# Altium schematic sheet SchemaC-mcu.SchDoc
size A3; Organization: ETML-ES; Address1: Avenue Recordon 1; Address2: 1004 Lausanne; Address3: Switzerland; SheetNumber: 3; SheetTotal: 3
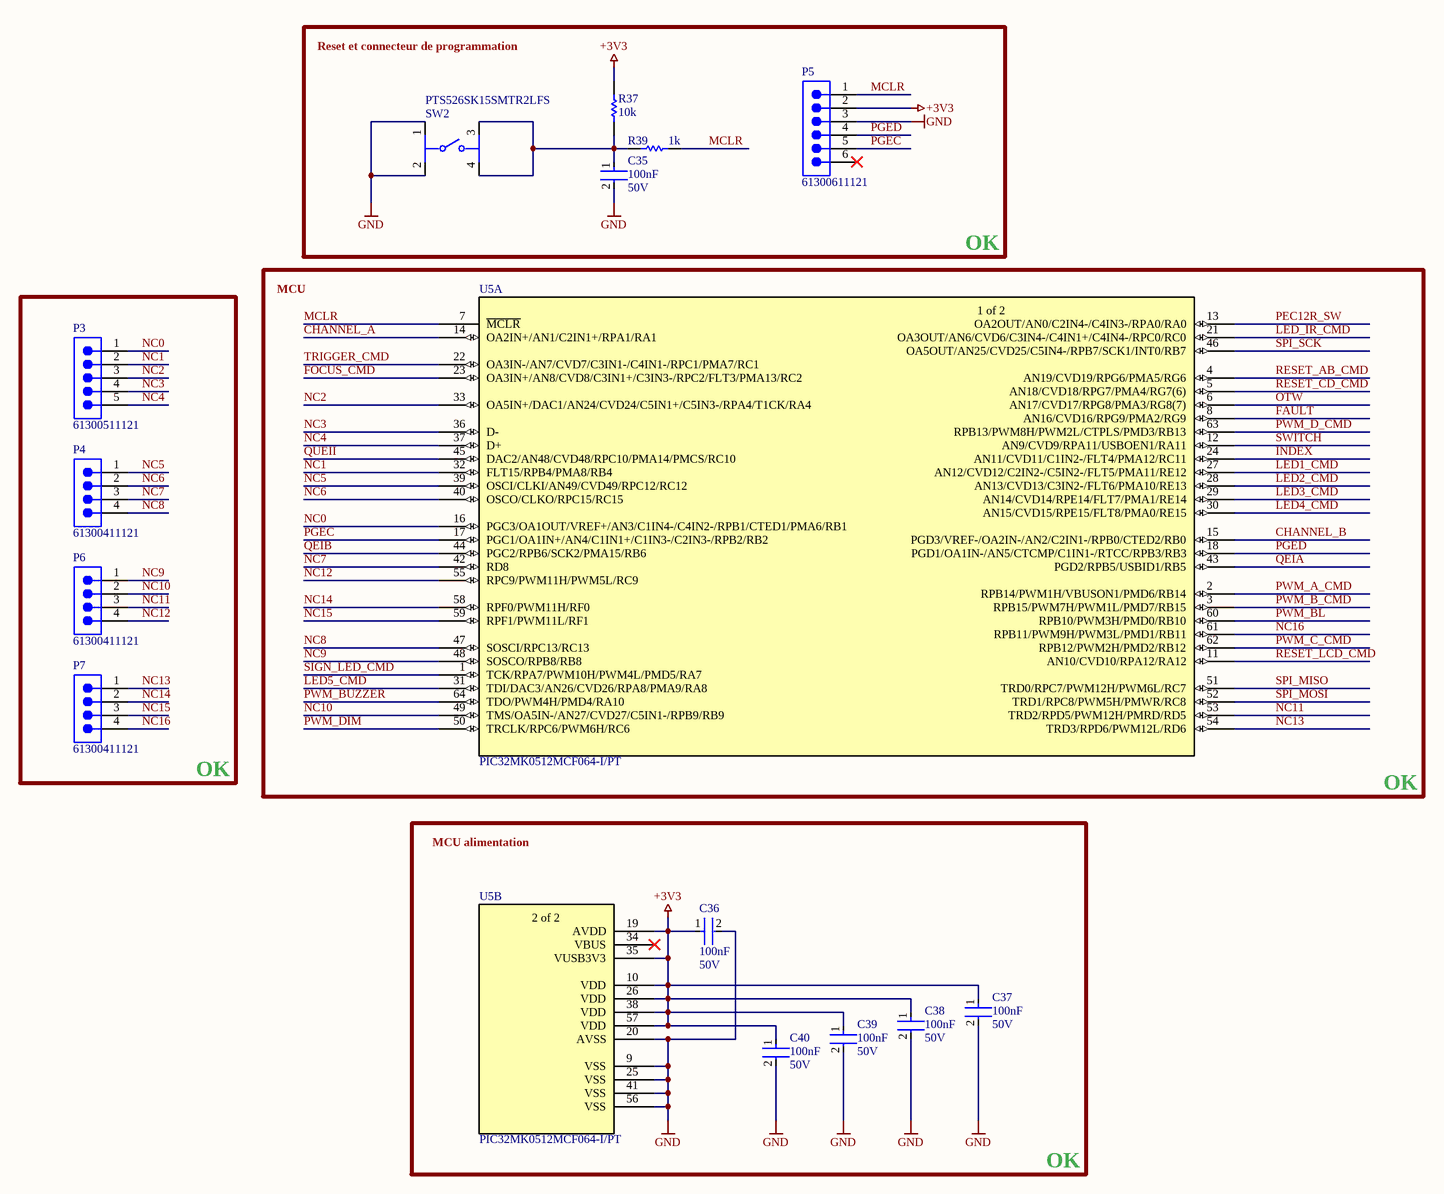
[diagram p0: SchemaC-mcu.SchDoc]

## Parts
C35  Capacitance: 100nF  Voltage Rating: 50V  [FP-CL21-IPC_C]  (hidden comment: CL21B104KBCNNNC)
C36  Capacitance: 100nF  Voltage Rating: 50V  [FP-CL21-IPC_C]  (hidden comment: CL21B104KBCNNNC)
C37  Capacitance: 100nF  Voltage Rating: 50V  [FP-CL21-IPC_C]  (hidden comment: CL21B104KBCNNNC)
C38  Capacitance: 100nF  Voltage Rating: 50V  [FP-CL21-IPC_C]  (hidden comment: CL21B104KBCNNNC)
C39  Capacitance: 100nF  Voltage Rating: 50V  [FP-CL21-IPC_C]  (hidden comment: CL21B104KBCNNNC)
C40  Capacitance: 100nF  Voltage Rating: 50V  [FP-CL21-IPC_C]  (hidden comment: CL21B104KBCNNNC)
P3  61300511121  [61300511121]
P4  61300411121  [61300411121]
P5  61300611121  [61300611121]
P6  61300411121  [61300411121]
P7  61300411121  [61300411121]
R37  Resistance: 10k  [RESC2013X60X35ML10T20]  (hidden comment: RC0805JR-0710KL)
R39  Resistance: 1k  [RESC2013X60X35ML10T20]  (hidden comment: RC0805FR-071KL)
SW2  PTS526SK15SMTR2LFS  [FP-PTS526SK15SMTR2LFS-MFG]
U5  PIC32MK0512MCF064-I/PT  [TQFP64_PT_MCH]  (parts A,B of 2)

## Blocks framed on the sheet
OK: C35 P5 R37 R39 SW2
OK: P3 P4 P6 P7
OK: U5
OK: C36-C40 U5

## Nets
+3V3: C36.1 C37.1 C38.1 C39.1 C40.1 P5.2 R37.1 U5.10(VDD) U5.19(AVDD) U5.26(VDD) U5.35(VUSB3V3) U5.38(VDD) U5.57(VDD)
GND: C35.2 C36.2 C37.2 C38.2 C39.2 C40.2 P5.3 SW2.1 SW2.2 U5.9(VSS) U5.20(AVSS) U5.25(VSS) U5.41(VSS) U5.56(VSS)
CHANNEL_A: U5.14(OA2IN+/AN1/C2IN1+/RPA1/RA1)
CHANNEL_B: U5.15(PGD3/VREF-/OA2IN-/AN2/C2IN1-/RPB0/CTED2/RB0)
FAULT: U5.8(AN16/CVD16/RPG9/PMA2/RG9)
FOCUS_CMD: U5.23(OA3IN+/AN8/CVD8/C3IN1+/C3IN3-/RPC2/FLT3/PMA13/RC2)
INDEX: U5.24(AN11/CVD11/C1IN2-/FLT4/PMA12/RC11)
LED1_CMD: U5.27(AN12/CVD12/C2IN2-/C5IN2-/FLT5/PMA11/RE12)
LED2_CMD: U5.28(AN13/CVD13/C3IN2-/FLT6/PMA10/RE13)
LED3_CMD: U5.29(AN14/CVD14/RPE14/FLT7/PMA1/RE14)
LED4_CMD: U5.30(AN15/CVD15/RPE15/FLT8/PMA0/RE15)
LED5_CMD: U5.31(TDI/DAC3/AN26/CVD26/RPA8/PMA9/RA8)
LED_IR_CMD: U5.21(OA3OUT/AN6/CVD6/C3IN4-/C4IN1+/C4IN4-/RPC0/RC0)
MCLR: P5.1 R39.2 U5.7(~{MCLR})
NC0: P3.1 U5.16(PGC3/OA1OUT/VREF+/AN3/C1IN4-/C4IN2-/RPB1/CTED1/PMA6/RB1)
NC1: P3.2 U5.32(FLT15/RPB4/PMA8/RB4)
NC2: P3.3 U5.33(OA5IN+/DAC1/AN24/CVD24/C5IN1+/C5IN3-/RPA4/T1CK/RA4)
NC3: P3.4 U5.36(D-)
NC4: P3.5 U5.37(D+)
NC5: P4.1 U5.39(OSCI/CLKI/AN49/CVD49/RPC12/RC12)
NC6: P4.2 U5.40(OSCO/CLKO/RPC15/RC15)
NC7: P4.3 U5.42(RD8)
NC8: P4.4 U5.47(SOSCI/RPC13/RC13)
NC9: P6.1 U5.48(SOSCO/RPB8/RB8)
NC10: P6.2 U5.49(TMS/OA5IN-/AN27/CVD27/C5IN1-/RPB9/RB9)
NC11: P6.3 U5.53(TRD2/RPD5/PWM12H/PMRD/RD5)
NC12: P6.4 U5.55(RPC9/PWM11H/PWM5L/RC9)
NC13: P7.1 U5.54(TRD3/RPD6/PWM12L/RD6)
NC14: P7.2 U5.58(RPF0/PWM11H/RF0)
NC15: P7.3 U5.59(RPF1/PWM11L/RF1)
NC16: P7.4 U5.61(RPB11/PWM9H/PWM3L/PMD1/RB11)
OTW: U5.6(AN17/CVD17/RPG8/PMA3/RG8(7))
PEC12R_SW: U5.13(OA2OUT/AN0/C2IN4-/C4IN3-/RPA0/RA0)
PGEC: P5.5 U5.17(PGC1/OA1IN+/AN4/C1IN1+/C1IN3-/C2IN3-/RPB2/RB2)
PGED: P5.4 U5.18(PGD1/OA1IN-/AN5/CTCMP/C1IN1-/RTCC/RPB3/RB3)
PWM_A_CMD: U5.2(RPB14/PWM1H/VBUSON1/PMD6/RB14)
PWM_B_CMD: U5.3(RPB15/PWM7H/PWM1L/PMD7/RB15)
PWM_BL: U5.60(RPB10/PWM3H/PMD0/RB10)
PWM_BUZZER: U5.64(TDO/PWM4H/PMD4/RA10)
PWM_C_CMD: U5.62(RPB12/PWM2H/PMD2/RB12)
PWM_D_CMD: U5.63(RPB13/PWM8H/PWM2L/CTPLS/PMD3/RB13)
PWM_DIM: U5.50(TRCLK/RPC6/PWM6H/RC6)
QEIA: U5.43(PGD2/RPB5/USBID1/RB5)
QEIB: U5.44(PGC2/RPB6/SCK2/PMA15/RB6)
QUEII: U5.45(DAC2/AN48/CVD48/RPC10/PMA14/PMCS/RC10)
RESET_AB_CMD: U5.4(AN19/CVD19/RPG6/PMA5/RG6)
RESET_CD_CMD: U5.5(AN18/CVD18/RPG7/PMA4/RG7(6))
RESET_LCD_CMD: U5.11(AN10/CVD10/RPA12/RA12)
SIGN_LED_CMD: U5.1(TCK/RPA7/PWM10H/PWM4L/PMD5/RA7)
SPI_MISO: U5.51(TRD0/RPC7/PWM12H/PWM6L/RC7)
SPI_MOSI: U5.52(TRD1/RPC8/PWM5H/PMWR/RC8)
SPI_SCK: U5.46(OA5OUT/AN25/CVD25/C5IN4-/RPB7/SCK1/INT0/RB7)
SWITCH: U5.12(AN9/CVD9/RPA11/USBOEN1/RA11)
TRIGGER_CMD: U5.22(OA3IN-/AN7/CVD7/C3IN1-/C4IN1-/RPC1/PMA7/RC1)
NetC35_1: C35.1 R37.2 R39.1 SW2.3 SW2.4

Not connected (* = marked no-connect by the designer): P5 6*; U5 34(VBUS)*

## Notes on the sheet
- Reset et connecteur de programmation
- MCU
- MCU alimentation
- Fichier :
- a
- Date :
- Heure :
- Version :
- Auteur :
- Modif.
- b
- c
- d
- Projet :
- No :
- Nb feuilles
- Feuille n°
- Chemin :
- (in symbol PIC32MK0512MCF064-I/PT, part A) 1 of 2
- (in symbol PIC32MK0512MCF064-I/PT, part B) 2 of 2

## Library data of the parts
C35-C40 = CMP-2000-05017-2: CL21 Series 0805 100nF 50V ±10% Tolerance X7R Multilayer Ceramic Chip Capacitor; Depth: 1.25mm; Height: 0.85mm; Width: 0.049inch; Tolerance: 10%; Case Code (Metric): 2012; Case Code (Imperial): 0805; Material: Ceramic; Thickness: 0.037inch; Min Operating Temperature: -55°C; Contact Plating: Tin; Length: 2mm; Mount: Surface Mount; Voltage Rating (DC): 50V; Lead Free: Lead Free; Dielectric: X7R; Radiation Hardening: No; Case/Package: 0805; Packaging: Tape and Reel; Max Operating Temperature: 125°C; Voltage: 50V
P3 = CMP-1502-01068-2: NexarPartId: 32855526; Operating Supply Voltage: 250V; Number of Contacts: 5; Connector Type: Male Pin; Current Rating: 3A; Contact Resistance: 20mΩ; Pitch: 2.54mm; Gender: Male; Termination: Solder; RoHS: Compliant; Lead Pitch: 2.54mm; Contact Mating Length: 5.9944mm; Number of Positions: 5; Lead Free: Lead Free; Contact Plating: Gold; Number of Pins: 5; Min Operating Temperature: -40°C; Voltage Rating: 250V; Color: Black; Mount: Through Hole; REACH SVHC: Unknown; Packaging: Bulk; Height: 8.89mm; Number of Rows: 1; Orientation: Vertical; Contact Material: Copper; Max Operating Temperature: 105°C
P4 P6 P7 = CMP-1502-01064-2: NexarPartId: 32855522; Pitch: 2.54mm; Number of Contacts: 4; Contact Resistance: 20mΩ; Gender: Male; Current Rating: 3A; Connector Type: Male Pin; Voltage Rating: 250V; Lead Free: Lead Free; Contact Plating: Gold; Max Operating Temperature: 105°C; Packaging: Bulk; Height: 8.89mm; Orientation: Vertical; Contact Mating Length: 5.9944mm; Contact Material: Copper; Lead Pitch: 2.54mm; Min Operating Temperature: -40°C; Termination: Solder; Color: Black; Number of Rows: 1; REACH SVHC: Unknown; RoHS: Compliant; Mount: Through Hole; Number of Positions: 4; Number of Pins: 4; Operating Supply Voltage: 250V
P5 = CMP-1502-01070-2: NexarPartId: 20084590; Operating Supply Voltage: 250V; Current Rating: 3A; Number of Contacts: 6; Gender: Male; Connector Type: Male Pin; Pitch: 2.54mm; Contact Resistance: 20mΩ; Lead Free: Lead Free; REACH SVHC: Unknown; Number of Rows: 1; Color: Black; Min Operating Temperature: -40°C; Contact Material: Copper; Lead Pitch: 2.54mm; Contact Plating: Gold; Number of Pins: 6; Height: 8.89mm; Orientation: Vertical; Termination: Through Hole; Mount: Through Hole; RoHS: Compliant; Contact Gender: Male; Contact Mating Length: 5.9944mm; Voltage Rating: 250V; Number of Positions: 6; Housing Material: PBT; Packaging: Bulk; Max Operating Temperature: 105°C
R37 = CMP-2000-05025-1: Chip Resistor, 10 KOhm, +/- 5%, 0.125 W, -55 to 155 degC, 0805 (2012 Metric), RoHS, Tape and Reel; Manufacturer: Yageo; Resistor Element Type: ThickFilm; Voltage Rating: 150V; Product Range: RCSeries; SVHC: ToBeAdvised; Resistor Case Style: 0805[2012Metric]; Temperature Coefficient: ±100ppm/degC; Power Rating: 250mW; Automotive Qualification Standard: -; Datasheet Version: REV. 2, 09/2004; Packaging: CutTape; Resistance Tolerance: ±5%; MSL: MSL1-Unlimited; Manufacturer URL: http://www.yageo.com/; Datasheet URL: http://www.yageo.ru/pdf/RC0805.pdf; Package Description: 2-Pin Surface Mounted Device, Body 2 x 1.25 mm; Package Reference: 805
R39 = CMP-2100-03671-1: Chip Resistor, 1 KOhm, +/- 1%, 125 mW, -55 to 155 degC, 0805 (2012 Metric), RoHS, Tape and Reel; Manufacturer: Yageo; Temperature Coefficient: 100ppm/degreesC; Voltage Rating (DC): 150V; Max Power Dissipation: 125mW; Number of Pins: 2; Number of Terminations: 2; Datasheet URL: http://www.yageo.com/NewPortal/yageodocoutput?fileName=/pdf/R-Chip/PYu-RC_Group_51_RoHS_L_5.pdf; Length: 0.079inch; Package Description: 2-Pin Surface Mounted Device, Body 2 x 1.25 mm; Depth: 1.25mm; Height: 0.024inch; Military Standard: Not; Case/Package: 0805; Package Reference: 0805; RoHSCompliant: true; Lead Free: LeadFree; Packaging: TapeandReel; Package Quantity: 1; Datasheet Version: Rev. 5, 10/2016; Tolerance: 1%; Min Operating Temperature: -55degC; Voltage Rating: 150V; Composition: ThickFilm; Case Code (Imperial): 0805; Power Rating: 125mW; Width: 0.049inch; Case Code (Metric): 2012; Manufacturer URL: http://www.yageo.com/; Max Operating Temperature: 155degC; REACH SVHC: Unknown; Termination: SMD/SMT
SW2 = CMP-10040-000013-1: TACT 5.2 X 5.2, 1.5 MM H, 260GF,; Manufacturer: C&K; Operating Force: 250gf; Throw Configuration: SPST-NO; Contact Current Rating: 50mA; Standoff Height: 0mm; Contact Resistance: 100mΩ; Voltage Rating Dc: 12V; Electromechanical Life: 200000Cycles; Device Class L3: Tactile Switches; Device Class L2: Switches; Temperature: -20°C to +70°C; Temperature Range Low: -20°C; Package: PTS526SK15SMTR2LFS; Temperature Range High: +70°C; ComponentLink2Description: Datasheet; Device Class L1: Electromechanical; Height: 1.65mm; Digikey Description: TACT 5.2 X 5.2, 1.5 MM H, 260GF,; Category: Switch; RoHS: TRUE; Automotive: No; Lead Free: Yes; Manufacturer Part Number: PTS526SK15SMTR2LFS; Octopart: https://octopart.com/pts526+sk15+smtr2+lfs-c%26k+components-100617999; ComponentLink2URL: https://www.ckswitches.com/media/2780/pts526.pdf
U5 = PIC32MK0512MCF064-I/PT: Mfr_Name: Microchip; Copyright: Copyright (C) 2023 Ultra Librarian. All rights reserved.; Manufacturer_Part_Number: PIC32MK0512MCF064-I/PT; RefDes: RefDes; Type: DEV